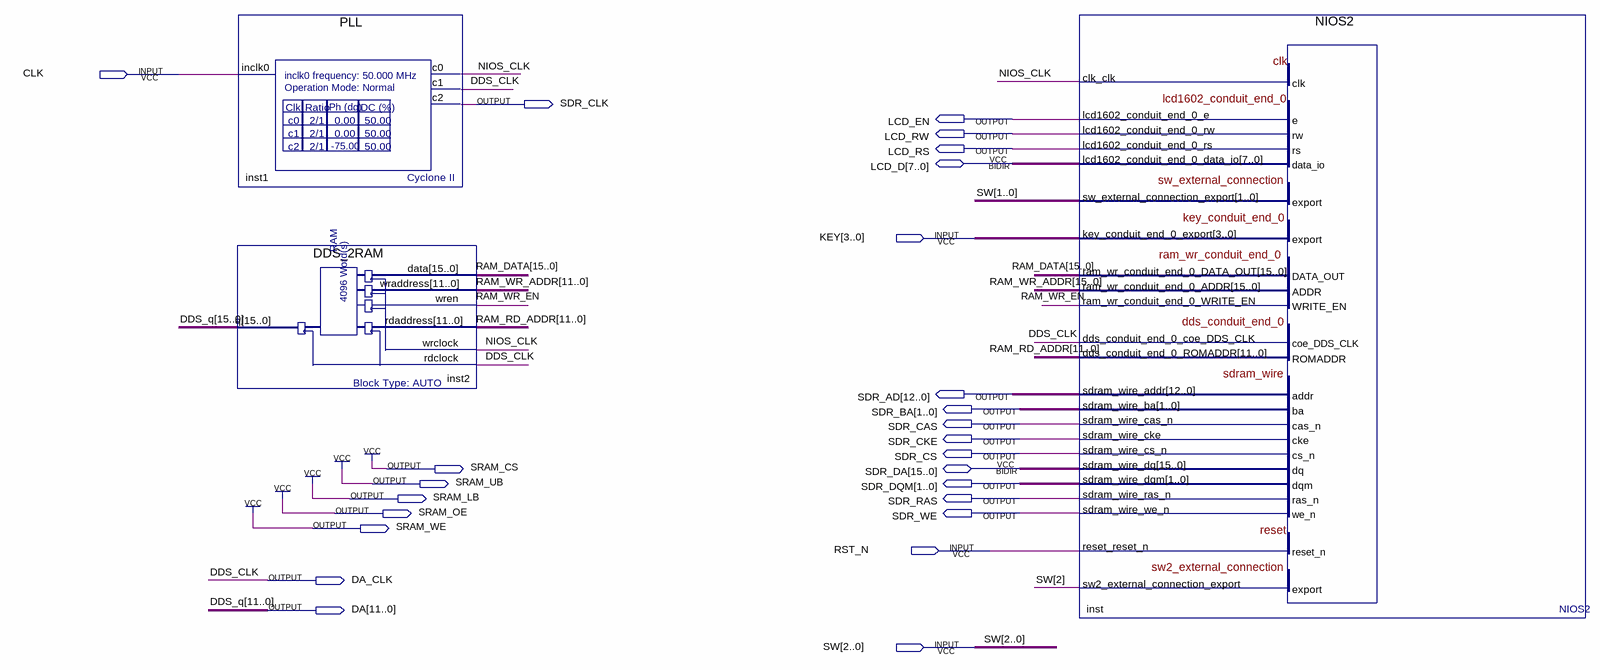
[diagram p0: schematic sheet]
// Quartus schematic DDS2.bdf as structural Verilog: 3 symbols, 25 pins
module DDS2 (
  input  CLK,
  input  [3:0] KEY,
  input  RST_N,
  input  [2:0] SW,
  inout  [7:0] LCD_D,
  inout  [15:0] SDR_DA,
  output SDR_CLK,
  output LCD_EN,
  output LCD_RW,
  output LCD_RS,
  output [12:0] SDR_AD,
  output [1:0] SDR_BA,
  output SDR_CAS,
  output SDR_CKE,
  output SDR_CS,
  output SRAM_CS,
  output SRAM_UB,
  output [1:0] SDR_DQM,
  output SRAM_LB,
  output SDR_RAS,
  output SRAM_OE,
  output SDR_WE,
  output SRAM_WE,
  output DA_CLK,
  output [11:0] DA
);

  wire NIOS_CLK, RAM_WR_EN;
  wire [11:0] RAM_RD_ADDR;
  wire [15:0] RAM_DATA, RAM_WR_ADDR;
  wire [15:12] DDS_q;

  PLL inst1 (.inclk0(CLK), .c0(NIOS_CLK), .c1(DA_CLK), .c2(SDR_CLK));
  DDS_2RAM inst2 (
    .data(RAM_DATA), .wraddress(RAM_WR_ADDR[11:0]), .wren(RAM_WR_EN), .rdaddress(RAM_RD_ADDR),
    .wrclock(NIOS_CLK), .rdclock(DA_CLK), .q({DDS_q, DA}));
  NIOS2 inst (
    .clk_clk(NIOS_CLK), .sw_external_connection_export(SW[1:0]), .key_conduit_end_0_export(KEY),
    .dds_conduit_end_0_coe_DDS_CLK(DA_CLK), .reset_reset_n(RST_N), .sw2_external_connection_export(SW[2]),
    .lcd1602_conduit_end_0_e(LCD_EN), .lcd1602_conduit_end_0_rw(LCD_RW), .lcd1602_conduit_end_0_rs(LCD_RS),
    .ram_wr_conduit_end_0_ADDR(RAM_WR_ADDR), .ram_wr_conduit_end_0_WRITE_EN(RAM_WR_EN),
    .dds_conduit_end_0_ROMADDR(RAM_RD_ADDR), .sdram_wire_addr(SDR_AD), .sdram_wire_ba(SDR_BA),
    .sdram_wire_cas_n(SDR_CAS), .sdram_wire_cke(SDR_CKE), .sdram_wire_cs_n(SDR_CS), .sdram_wire_dqm(SDR_DQM),
    .sdram_wire_ras_n(SDR_RAS), .sdram_wire_we_n(SDR_WE), .lcd1602_conduit_end_0_data_io(LCD_D),
    .ram_wr_conduit_end_0_DATA_OUT(RAM_DATA), .sdram_wire_dq(SDR_DA));

  assign SRAM_CS = 1'b1;
  assign SRAM_LB = 1'b1;
  assign SRAM_OE = 1'b1;
  assign SRAM_UB = 1'b1;
  assign SRAM_WE = 1'b1;

  // Other names for the same wires on the sheet: DDS_CLK = DA_CLK; DDS_q[11:0] = DA
endmodule
